# Altium schematic sheet make_etf_great_again.SchDoc
size A; SheetNumber: 1; SheetTotal: 5
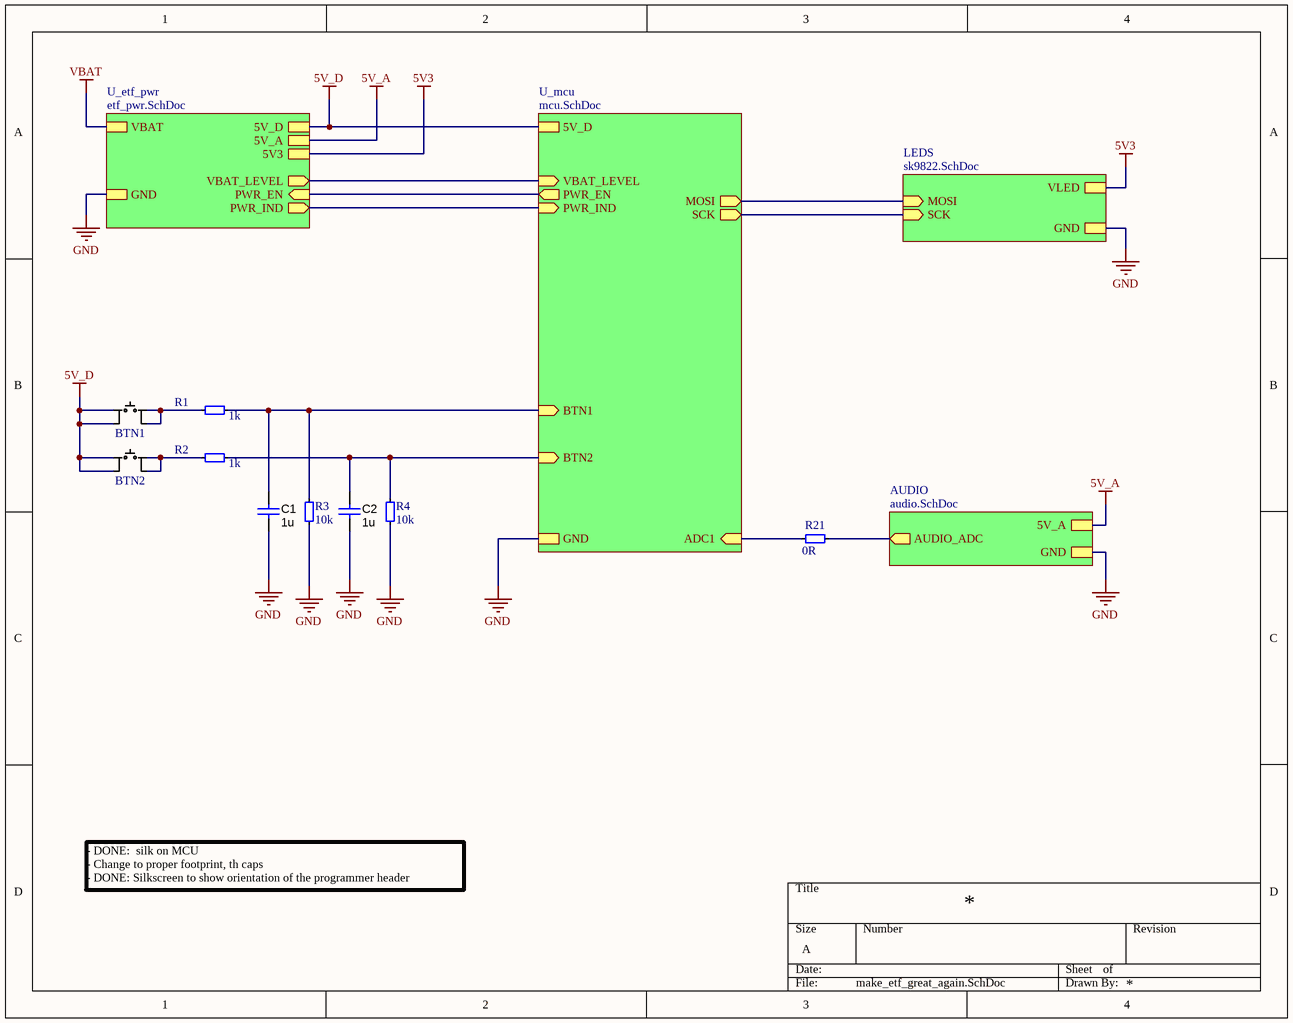
[diagram p0: make_etf_great_again.SchDoc]

## Parts
BTN1  Tactile Button  [SW_TS02-66-150-BK-160-LCR-D]  (value not drawn)
BTN2  Tactile Button  [SW_TS02-66-150-BK-160-LCR-D]  (value not drawn)
C1  value 1u  [1206_180]  (hidden comment: CAP, 1206)
C2  value 1u  [1206_180]  (hidden comment: CAP, 1206)
R1  value 1k  [TH]  (hidden comment: TH, resistor)
R2  value 1k  [TH]  (hidden comment: TH, resistor)
R3  value 10k  [TH]  (hidden comment: TH, resistor)
R4  value 10k  [TH]  (hidden comment: TH, resistor)
R21  value 0R  [0603]  (hidden comment: 0603, resistor)

## Sub-sheets
AUDIO = audio.SchDoc: AUDIO_ADC (out), 5V_A, GND
LEDS = sk9822.SchDoc: MOSI (in), SCK (in), VLED, GND
U_etf_pwr = etf_pwr.SchDoc: 5V_D, 5V_A, GND, VBAT_LEVEL (out), PWR_EN (in), VBAT, 5V3, PWR_IND (out)
U_mcu = mcu.SchDoc: MOSI (out), SCK (out), 5V_D, GND, BTN1 (in), BTN2 (in), ADC1 (in), PWR_EN (out), VBAT_LEVEL (in), PWR_IND (in)

## Nets
5V3: sheet LEDS/VLED, sheet U_etf_pwr/5V3
5V_A: sheet U_etf_pwr/5V_A, sheet AUDIO/5V_A
5V_D: BTN1.3 BTN1.4 BTN2.3 BTN2.4 ; sheet U_etf_pwr/5V_D, sheet U_mcu/5V_D
GND: C1.2 C2.2 R3.1 R4.1 ; sheet LEDS/GND, sheet U_etf_pwr/GND, sheet AUDIO/GND, sheet U_mcu/GND
VBAT: sheet U_etf_pwr/VBAT
NetBTN1_1: BTN1.1 BTN1.2 R1.1
NetBTN2_1: BTN2.1 BTN2.2 R2.1
NetC1_1: C1.1 R1.2 R3.2 ; sheet U_mcu/BTN1
NetC2_1: C2.1 R2.2 R4.2 ; sheet U_mcu/BTN2
NetR21_0: R21.0 ; sheet AUDIO/AUDIO_ADC
NetR21_1: R21.1 ; sheet U_mcu/ADC1
(unnamed): sheet LEDS/MOSI, sheet U_mcu/MOSI
(unnamed): sheet LEDS/SCK, sheet U_mcu/SCK
(unnamed): sheet U_etf_pwr/VBAT_LEVEL, sheet U_mcu/VBAT_LEVEL
(unnamed): sheet U_etf_pwr/PWR_EN, sheet U_mcu/PWR_EN
(unnamed): sheet U_etf_pwr/PWR_IND, sheet U_mcu/PWR_IND

## Notes on the sheet
- - DONE:  silk on MCU
  - Change to proper footprint, th caps
  - DONE: Silkscreen to show orientation of the programmer header

## Library data of the parts
BTN1 BTN2 = TacButton TH: Tactile Switch Small Low; Mount: No; Value: Button
C1 C2 = CAP, 1206: Manufacturer Part Number: CC1206JKX7R7BB105; JLCPCB Part #: C527272; Mount: Yes
R1-R4 = TH, resistor: Mount: No
R21 = 0603, resistor: Manufacturer Part Number: RC0603JR-070RL; JLCPCB Part #: C95177; Mount: Yes